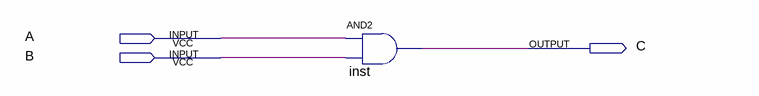
[diagram p0: schematic sheet]
// Quartus schematic TPdeBase.bdf as structural Verilog: 1 symbols, 3 pins
module TPdeBase (
  input  A,
  input  B,
  output C
);

  and inst (C, A, B);
endmodule
